# EAGLE design uBike (EAGLE 9.5.1)

## Sheet 1 of 3
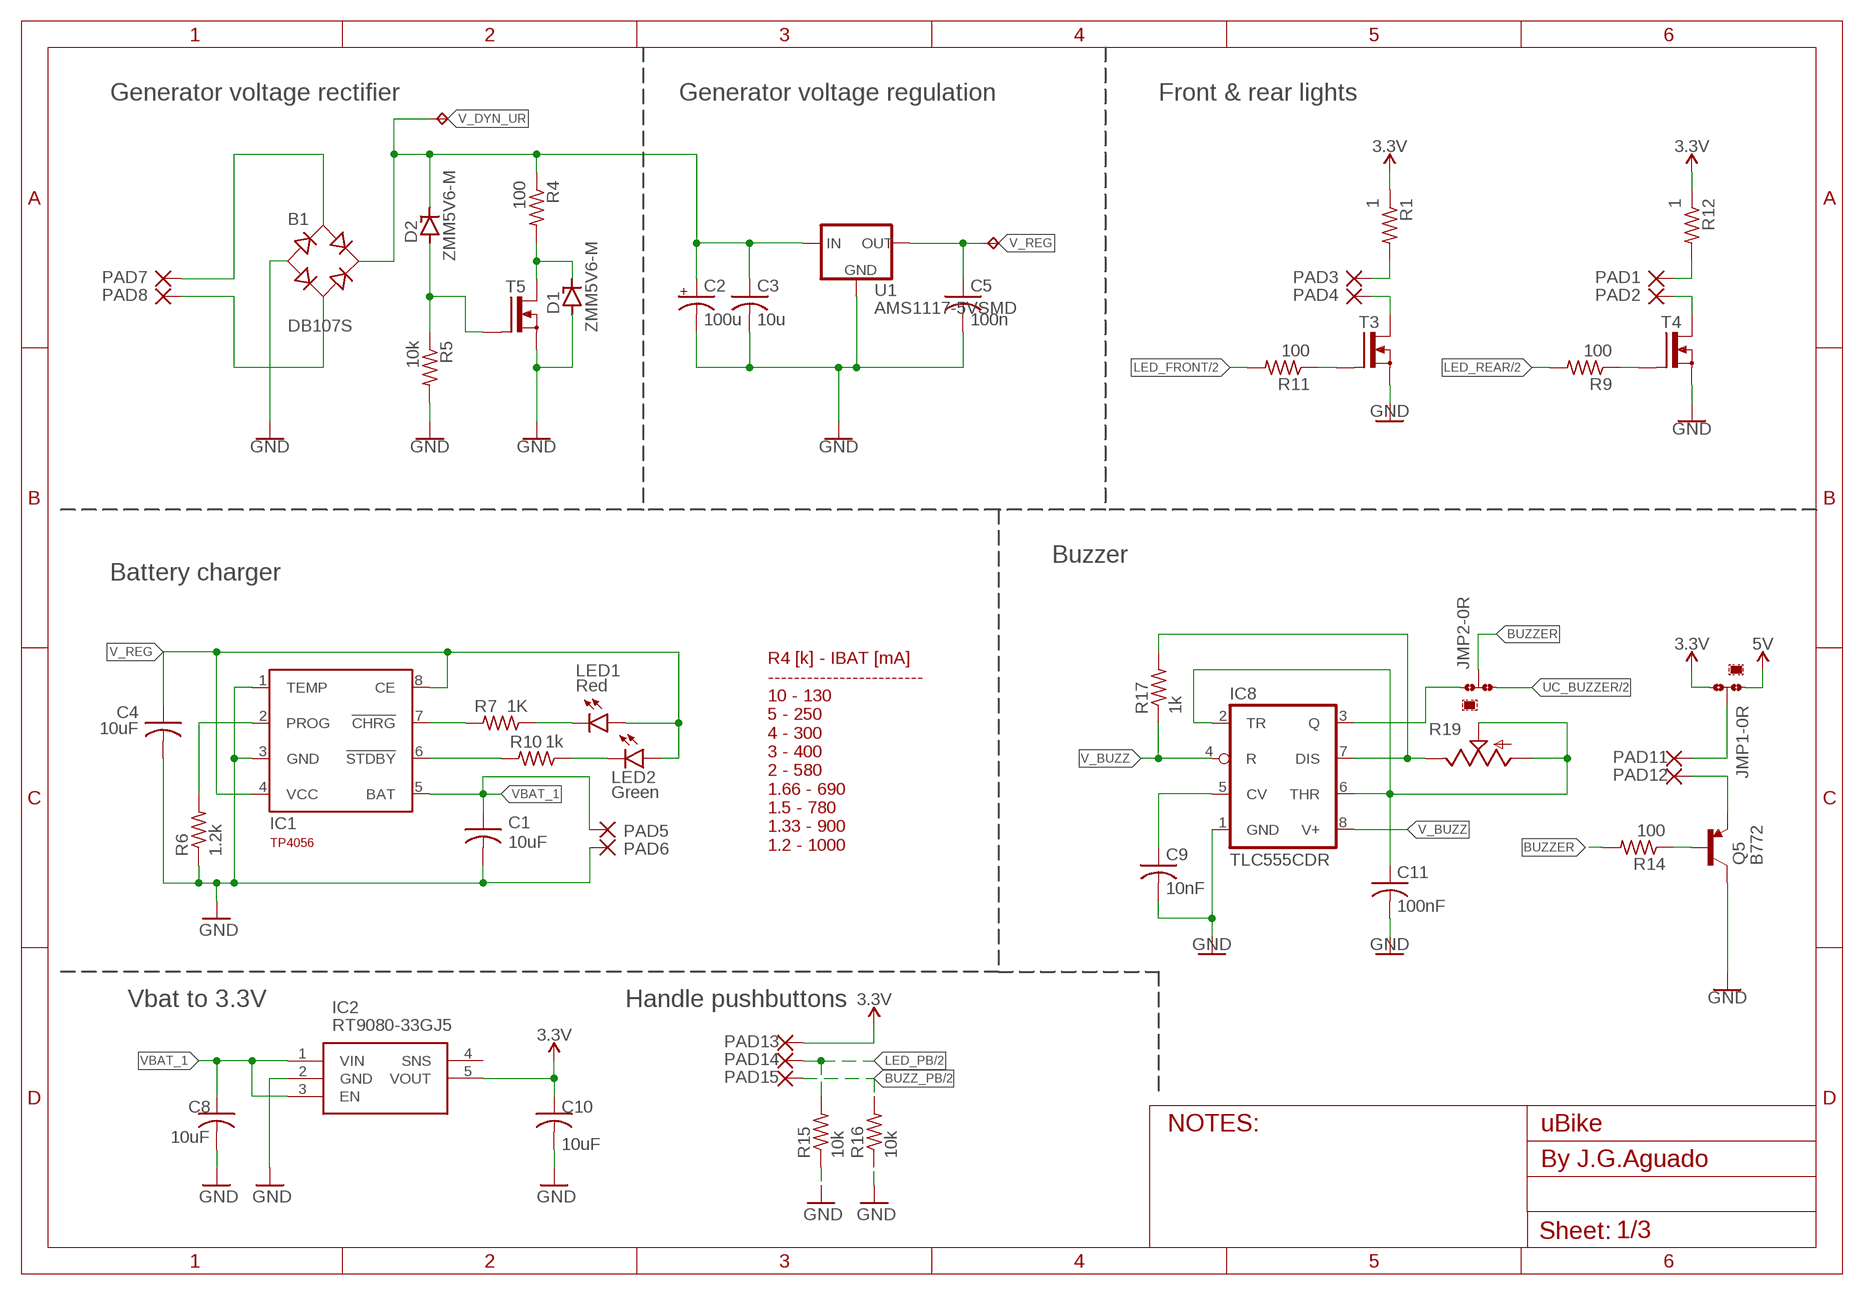
[diagram p0: schematic, sheet 1]

### Parts
B1  DB107S  DBS107G  [DBS]
C1  10uF  C-USC0603  [C0603]
C2  100u  C3528  [B/3528-21R]
C3  10u  C-USC0603  [C0603]
C4  10uF  C-USC0603  [C0603]
C5  100n  C-USC0603  [C0603]
C8  10uF  C-USC0603  [C0603]
C9  10nF  C-USC0603  [C0603]
C10  10uF  C-USC0603  [C0603]
C11  100nF  C-USC0603  [C0603]
D1  ZMM5V6-M  ZD_ZMM5V6_ST_MLL34  [MELF-MLL34]
D2  ZMM5V6-M  ZD_ZMM5V6_ST_MLL34  [MELF-MLL34]
IC1  TP4056  [SOT23-8]
IC2  RT9080-33GJ5  [SOT94P280X100-5N]
IC8  TLC555CDR  NE555D  [SO08]
JMP1  0R-JUMPA  [A0R-JMP]
JMP2  0R-JUMPA  [A0R-JMP]
LED1  Red  LED0603  [LED_0603]
LED2  Green  LED0603  [LED_0603]
PAD1  SMD2  [SMD1,27-2,54]
PAD2  SMD2  [SMD1,27-2,54]
PAD3  SMD2  [SMD1,27-2,54]
PAD4  SMD2  [SMD1,27-2,54]
PAD5  SMD2  [SMD1,27-2,54]
PAD6  SMD2  [SMD1,27-2,54]
PAD7  SMD2  [SMD1,27-2,54]
PAD8  SMD2  [SMD1,27-2,54]
PAD11  SMD2  [SMD1,27-2,54]
PAD12  SMD2  [SMD1,27-2,54]
PAD13  SMD2  [SMD1,27-2,54]
PAD14  SMD2  [SMD1,27-2,54]
PAD15  SMD2  [SMD1,27-2,54]
Q5  B772  TRANSISTOR_PNPSMD-2  [SOT89]
R1  1  R-US_R1206  [R1206]
R4  100  R0402  [0402]
R5  10k  R0402  [0402]
R6  1.2k  R0402  [0402]
R7  1K  R0402  [0402]
R9  100  R0402  [0402]
R10  1k  R0402  [0402]
R11  100  R0402  [0402]
R12  1  R-US_R1206  [R1206]
R14  100  R0402  [0402]
R15  10k  R0402  [0402]
R16  10k  R0402  [0402]
R17  1k  R0402  [0402]
R19  TRIM_US-RJ9W  [RJ9W]
T3  T_N-MOSFET_2N7002_CHANGJ_SOT23-GSD  [SOT23]
T4  T_N-MOSFET_2N7002_CHANGJ_SOT23-GSD  [SOT23]
T5  T_N-MOSFET_2N7002_CHANGJ_SOT23-GSD  [SOT23]
TP1  TPTP15R  [TP15R]
TP3  TPTP15R  [TP15R]
U1  AMS1117-5VSMD  [SOT223]

### Nets
3.3V: C10.1 IC2.5(VOUT) JMP1.3 PAD13.1(P) R1.1 R12.1 ; also sheet 2,3
5V: JMP1.1
BUZZ_PB: PAD15.1(P) R16.2 ; also sheet 2,3
BUZZER: JMP2.2 R14.2
GND: B1.- C1.2 C2.- C3.2 C4.2 C5.2 C8.2 C9.2 C10.2 C11.2 D1.A IC1.1(TEMP) IC1.3(GND) IC2.2(GND) IC8.1(GND) PAD6.1(P) Q5.2(C) R5.2 R6.1 R15.1 R16.1 T3.2(S) T4.2(S) T5.2(S) U1.1(GND) ; also sheet 2,3
LED_FRONT: R11.2 ; also sheet 2,3
LED_PB: PAD14.1(P) R15.2 ; also sheet 2,3
LED_REAR: R9.2 ; also sheet 2,3
N$1: PAD3.1(P) R1.2
N$2: R9.1 T4.1(G)
N$3: IC1.6(!STDBY) R10.2
N$4: PAD4.1(P) T3.3(D)
N$5: R11.1 T3.1(G)
N$6: PAD2.1(P) T4.3(D)
N$7: D2.A R5.1 T5.1(G)
N$8: D1.C R4.2 T5.3(D)
N$10: B1.AC2 PAD8.1(P)
N$11: LED1.C R7.1
N$12: LED2.C R10.1
N$13: IC1.2(PROG) R6.2
N$14: B1.AC1 PAD7.1(P)
N$15: IC1.7(!CHRG) R7.2
N$16: Q5.1(B) R14.1
N$17: PAD12.1(P) Q5.3(E)
N$19: JMP1.2 PAD11.1(P)
N$20: PAD1.1(P) R12.2
N$34: IC8.7(DIS) R17.2 R19.E
N$35: C11.1 IC8.2(TR) IC8.6(THR) R19.A R19.S
N$36: IC8.3(Q) JMP2.1
N$37: C9.1 IC8.5(CV)
UC_BUZZER: JMP2.3 ; also sheet 2,3
V_BUZZ: IC8.4(R) IC8.8(V+) R17.1
V_DYN_UR: B1.+ C2.+ C3.1 D2.C R4.1 TP1.TP U1.3(IN)
V_REG: C4.1 C5.1 IC1.4(VCC) IC1.8(CE) LED1.A LED2.A TP3.TP U1.2(OUT)
VBAT_1: C1.1 C8.1 IC1.5(BAT) IC2.1(VIN) IC2.3(EN) PAD5.1(P)
Unconnected: IC2.4(SNS)

### Notes on the sheet
- Generator voltage rectifier | Generator voltage regulation | Front & rear lights
- Buzzer
- Battery charger
- R4 [k] - IBAT [mA]
  ------------------------
  10 - 130
  5 - 250
  4 - 300
  3 - 400
  2 - 580
  1.66 - 690
  1.5 - 780
  1.33 - 900
  1.2 - 1000
- Vbat to 3.3V | Handle pushbuttons

## Sheet 2 of 3
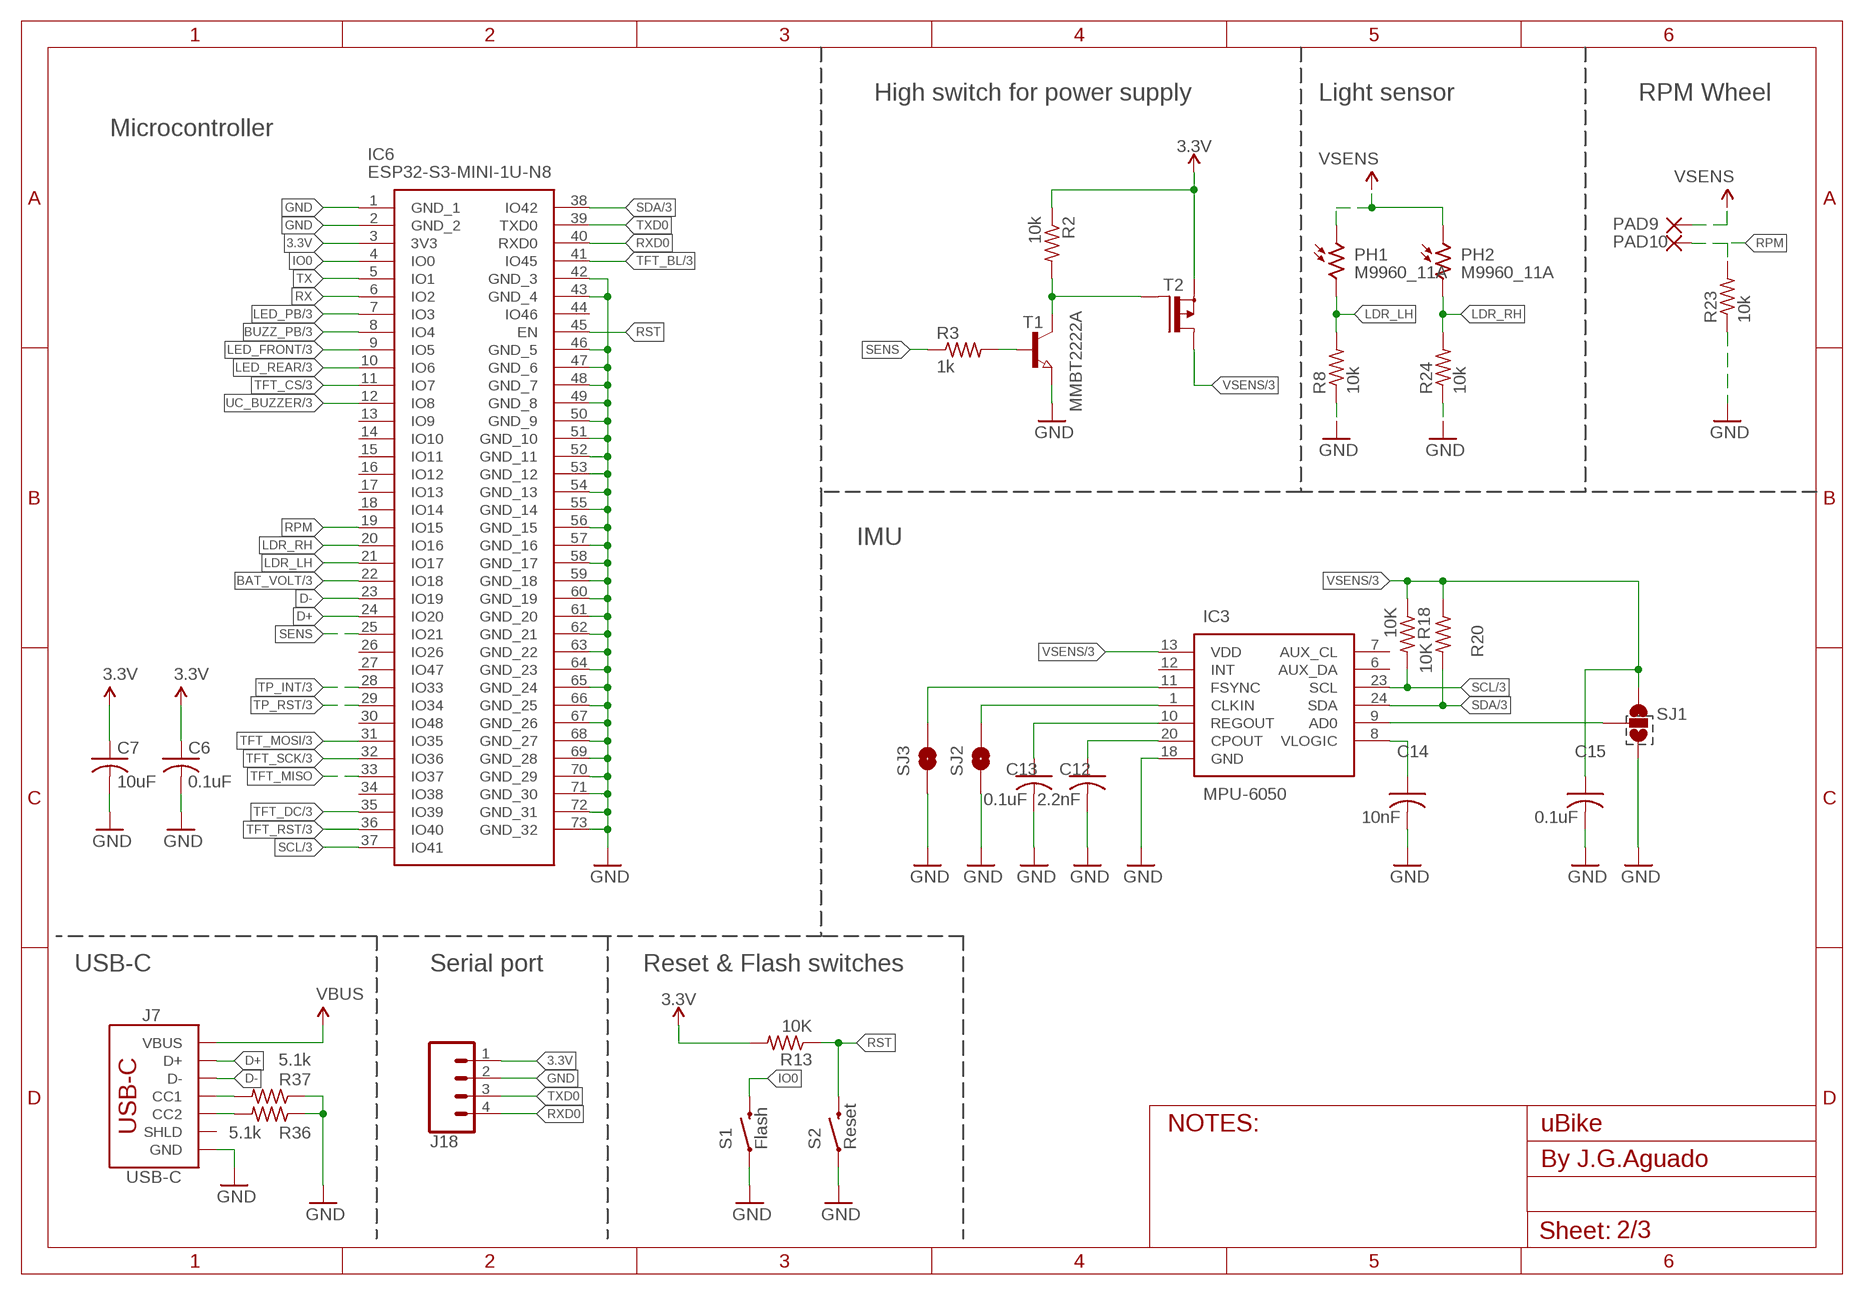
[diagram p1: schematic, sheet 2]

### Parts
C6  0.1uF  C-USC0603  [C0603]
C7  10uF  C-USC0603  [C0603]
C12  2.2nF  C-USC0603  [C0603]
C13  0.1uF  C-USC0603  [C0603]
C14  10nF  C-USC0603  [C0603]
C15  0.1uF  C-USC0603  [C0603]
IC3  MPU-6050  [MPU6050]
IC6  ESP32-S3-MINI-1U-N8  [ESP32S3MINI1UN8]
J7  USB-C  USB_C_4-LAYER-ISOLATED  [USB-C-16P-4LAYER-ISOLATED]
J18  CONN_04PTH  [1X04]
PAD9  SMD2  [SMD1,27-2,54]
PAD10  SMD2  [SMD1,27-2,54]
PH1  M9960_11A  [M9960]
PH2  M9960_11A  [M9960]
R2  10k  R0402  [0402]
R3  1k  R0402  [0402]
R8  10k  R0402  [0402]
R13  10K  R0402  [0402]
R18  10K  R0402  [0402]
R20  10K  R0402  [0402]
R23  10k  R0402  [0402]
R24  10k  R0402  [0402]
R36  5.1k  R-US_R0603  [R0603]
R37  5.1k  R-US_R0603  [R0603]
S1  Flash  MOMENTARY-SWITCH-SPST-SMD-5.2MM-TALL  [TACTILE_SWITCH_SMD_5.2MM]
S2  Reset  MOMENTARY-SWITCH-SPST-SMD-5.2MM-TALL  [TACTILE_SWITCH_SMD_5.2MM]
SJ1  SOLDERJUMPER_2WAYPASTE2&3  [SJ_3_PASTE2&3]
SJ2  SOLDERJUMPERTRACE  [SJ_2S-TRACE]
SJ3  SOLDERJUMPERTRACE  [SJ_2S-TRACE]
T1  MMBT2222A  T_NPN_MMBT2222A-1P_CHANGJ_SOT23-BEC  [SOT23]
T2  T_P-MOSFET_SI2301CDS-T1-GE3_VISHAY_SOT23-GSD  [SOT23]

### Nets
3.3V: C6.1 C7.1 IC6.3(3V3) J18.1 R2.1 R13.2 T2.2(S) ; also sheet 1,3
BAT_VOLT: IC6.22(IO18) ; also sheet 3
BUZZ_PB: IC6.8(IO4) ; also sheet 1,3
CC3: J7.B5(CC2) R36.2
CC4: J7.A5(CC1) R37.2
D+: IC6.24(IO20) J7.A6(D+) J7.B6(D+)
D-: IC6.23(IO19) J7.A7(D-) J7.B7(D-)
GND: C6.2 C7.2 C12.2 C13.2 C14.2 C15.2 IC3.18(GND) IC6.1(GND_1) IC6.2(GND_2) IC6.42(GND_3) IC6.43(GND_4) IC6.46(GND_5) IC6.47(GND_6) IC6.48(GND_7) IC6.49(GND_8) IC6.50(GND_9) IC6.51(GND_10) IC6.52(GND_11) IC6.53(GND_12) IC6.54(GND_13) IC6.55(GND_14) IC6.56(GND_15) IC6.57(GND_16) IC6.58(GND_17) IC6.59(GND_18) IC6.60(GND_19) IC6.61(GND_20) IC6.62(GND_21) IC6.63(GND_22) IC6.64(GND_23) IC6.65(GND_24) IC6.66(GND_25) IC6.67(GND_26) IC6.68(GND_27) IC6.69(GND_28) IC6.70(GND_29) IC6.71(GND_30) IC6.72(GND_31) IC6.73(GND_32) J7.GND J7.GND2(GND) J18.2 R8.1 R23.1 R24.1 R36.1 R37.1 S1.1 S2.1 SJ1.3 SJ2.1 SJ3.1 T1.2(E) ; also sheet 1,3
IO0: IC6.4(IO0) S1.3
LDR_LH: IC6.21(IO17) PH1.2 R8.2
LDR_RH: IC6.20(IO16) PH2.2 R24.2
LED_FRONT: IC6.9(IO5) ; also sheet 1,3
LED_PB: IC6.7(IO3) ; also sheet 1,3
LED_REAR: IC6.10(IO6) ; also sheet 1,3
N$9: R2.2 T1.3(C) T2.1(G)
N$18: R3.2 T1.1(B)
N$38: IC3.11(FSYNC) SJ3.2
N$39: IC3.1(CLKIN) SJ2.2
N$40: C13.1 IC3.10(REGOUT)
N$41: C12.1 IC3.20(CPOUT)
N$43: C14.1 IC3.8(VLOGIC)
N$44: IC3.9(AD0) SJ1.2
RPM: IC6.19(IO15) PAD10.1(P) R23.2
RST: IC6.45(EN) R13.1 S2.3
RX: IC6.6(IO2)
RXD0: IC6.40(RXD0) J18.4
SCL: IC3.23(SCL) IC6.37(IO41) R18.2 ; also sheet 3
SDA: IC3.24(SDA) IC6.38(IO42) R20.2 ; also sheet 3
SENS: IC6.25(IO21) R3.1
TFT_BL: IC6.41(IO45) ; also sheet 3
TFT_CS: IC6.11(IO7) ; also sheet 3
TFT_DC: IC6.35(IO39) ; also sheet 3
TFT_MISO: IC6.33(IO37)
TFT_MOSI: IC6.31(IO35) ; also sheet 3
TFT_RST: IC6.36(IO40) ; also sheet 3
TFT_SCK: IC6.32(IO36) ; also sheet 3
TP_INT: IC6.28(IO33) ; also sheet 3
TP_RST: IC6.29(IO34) ; also sheet 3
TX: IC6.5(IO1)
TXD0: IC6.39(TXD0) J18.3
UC_BUZZER: IC6.12(IO8) ; also sheet 1,3
VBUS: J7.VBUS1(VBUS) J7.VBUS2(VBUS) ; also sheet 3
VSENS: C15.1 IC3.13(VDD) PAD9.1(P) PH1.1 PH2.1 R18.1 R20.1 SJ1.1 T2.3(D) ; also sheet 3
Unconnected: IC3.6(AUX_DA) IC3.7(AUX_CL) IC3.12(INT) IC6.13(IO9) IC6.14(IO10) IC6.15(IO11) IC6.16(IO12) IC6.17(IO13) IC6.18(IO14) IC6.26(IO26) IC6.27(IO47) IC6.30(IO48) IC6.34(IO38) IC6.44(IO46) J7.SHLD1(SHLD) J7.SHLD2(SHLD) J7.SHLD3(SHLD) J7.SHLD4(SHLD) J7.SHLD5(SHLD) J7.SHLD6(SHLD) J7.SHLD7(SHLD) J7.SHLD8(SHLD)

### Notes on the sheet
- High switch for power supply | Light sensor | RPM Wheel
- Microcontroller
- IMU
- USB-C | Serial port | Reset & Flash switches

## Sheet 3 of 3
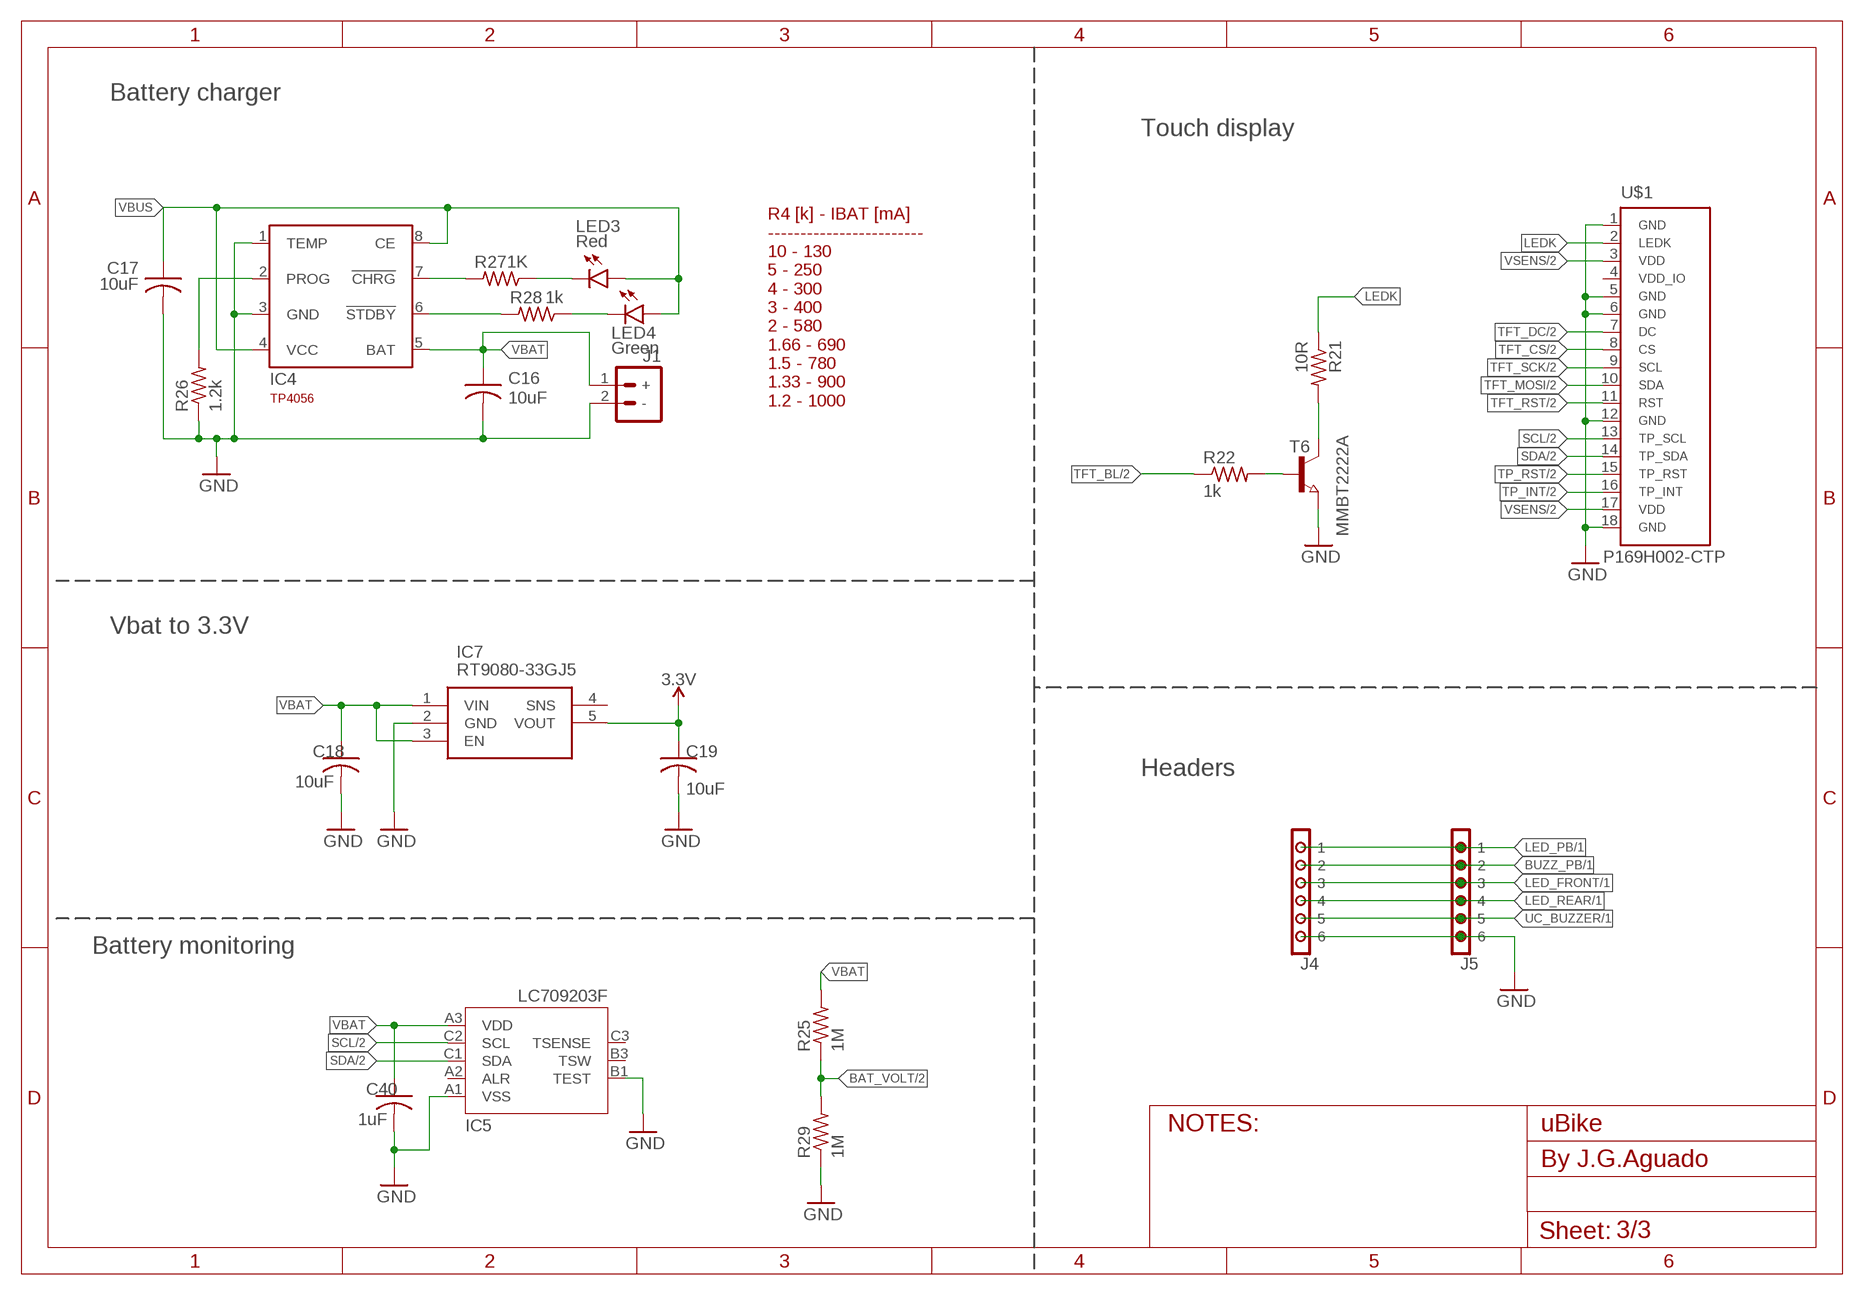
[diagram p2: schematic, sheet 3]

### Parts
C16  10uF  C-USC0603  [C0603]
C17  10uF  C-USC0603  [C0603]
C18  10uF  C-USC0603  [C0603]
C19  10uF  C-USC0603  [C0603]
C40  1uF  C-USC0603  [C0603]
IC4  TP4056  [SOT23-8]
IC5  LC709203F/MH  [WLCSP9]
IC7  RT9080-33GJ5  [SOT94P280X100-5N]
J1  BAT_CONN-JST-2MM-SMT  [JST-2-SMD]
J4  CONN_06  [1X06]
J5  CONN_06  [1X06]
LED3  Red  LED0603  [LED_0603]
LED4  Green  LED0603  [LED_0603]
R21  10R  R0402  [0402]
R22  1k  R0402  [0402]
R25  1M  R0402  [0402]
R26  1.2k  R0402  [0402]
R27  1K  R0402  [0402]
R28  1k  R0402  [0402]
R29  1M  R0402  [0402]
T6  MMBT2222A  T_NPN_MMBT2222A-1P_CHANGJ_SOT23-BEC  [SOT23]
U$1  P169H002-CTP  TOUCH-DISPLAY-FPCBOTTOM  [FPC_18_0.5MM_BOTTOM]

### Nets
3.3V: C19.1 IC7.5(VOUT) ; also sheet 1,2
BAT_VOLT: R25.1 R29.2 ; also sheet 2
BUZZ_PB: J4.2 J5.2 ; also sheet 1,2
GND: C16.2 C17.2 C18.2 C19.2 C40.2 IC4.1(TEMP) IC4.3(GND) IC5.A1(VSS) IC5.B1(TEST) IC7.2(GND) J1.2(-) J4.6 J5.6 R26.1 R29.1 T6.2(E) U$1.1 U$1.5 U$1.6 U$1.12 U$1.18 ; also sheet 1,2
LED_FRONT: J4.3 J5.3 ; also sheet 1,2
LED_PB: J4.1 J5.1 ; also sheet 1,2
LED_REAR: J4.4 J5.4 ; also sheet 1,2
LEDK: R21.1 U$1.2
N$33: R21.2 T6.3(C)
N$46: R22.2 T6.1(B)
N$47: IC4.6(!STDBY) R28.2
N$48: LED3.C R27.1
N$49: LED4.C R28.1
N$50: IC4.2(PROG) R26.2
N$51: IC4.7(!CHRG) R27.2
SCL: IC5.C2(SCL) U$1.13 ; also sheet 2
SDA: IC5.C1(SDA) U$1.14 ; also sheet 2
TFT_BL: R22.1 ; also sheet 2
TFT_CS: U$1.8 ; also sheet 2
TFT_DC: U$1.7 ; also sheet 2
TFT_MOSI: U$1.10 ; also sheet 2
TFT_RST: U$1.11 ; also sheet 2
TFT_SCK: U$1.9 ; also sheet 2
TP_INT: U$1.16 ; also sheet 2
TP_RST: U$1.15 ; also sheet 2
UC_BUZZER: J4.5 J5.5 ; also sheet 1,2
VBAT: C16.1 C18.1 C40.1 IC4.5(BAT) IC5.A3(VDD) IC7.1(VIN) IC7.3(EN) J1.1(+) R25.2
VBUS: C17.1 IC4.4(VCC) IC4.8(CE) LED3.A LED4.A ; also sheet 2
VSENS: U$1.3 U$1.17 ; also sheet 2
Unconnected: IC5.A2(ALR) IC5.B3(TSW) IC5.C3(TSENSE) IC7.4(SNS) U$1.4

### Notes on the sheet
- Battery charger
- Touch display
- R4 [k] - IBAT [mA]
  ------------------------
  10 - 130
  5 - 250
  4 - 300
  3 - 400
  2 - 580
  1.66 - 690
  1.5 - 780
  1.33 - 900
  1.2 - 1000
- Vbat to 3.3V
- Headers
- Battery monitoring

## Library data of the parts
B1 = rectifier:DB?*G: Single Phase 1.0 AMP Glass Passivated Bridge Rectifier Taiwan Semiconductor Co.,Ltd. - TSC Source: http://www.taiwansemi.com/TSCbig5/ezcatfiles/cust/img/img/db101g.pdf http://www.ts.com.tw/db/pictures/modules/PDT/PDT060207001/DBLS201G.pdf; LCSC: C5377
C1 C3-C19 C40 = rcl:C-US: CAPACITOR, American symbol; SPICEPREFIX: C
C2 = SpaceDIY_passive_components:C3528; LCSC: C16133
D1 D2 = JLC PCB Basic Parts_loc:ZD_: Zener Diode; LCSC_DATASHEET: https://datasheet.lcsc.com/lcsc/1809301122_ST-Semtech-ZMM5V6_C8062.pdf; LCSC_PART: C8062; LCSC_PRICE1_EUR: 0.021574803; LCSC_ROTATION_CCW: 180; PROPERTIES: 5.6V <100nA @ 1V 500mW LL-34 Zener Diodes ROHS
IC1 = TP4056:TP4056: TP4056 Data sheet <http://goo.gl/J7k8TF> Dave.Calaway Eagle Library <https://goo.gl/Muy1Tr>; LCSC: C16581
IC2 IC7 = SamacSys_Parts:RT9080-33GJ5: IC REG LIN 3.3V 600MA TSOT23-5 Source: Datasheet <https://www.richtek.com/assets/product_file/RT9080/DS9080-05.pdf>; DESCRIPTION: IC REG LIN 3.3V 600MA TSOT23-5; HEIGHT: 1mm; LCSC: C841192; MANUFACTURER_NAME: RICHTEK; MANUFACTURER_PART_NUMBER: RT9080-33GJ5
IC3 = SpaceDIY_IC:MPU-6050: IMUs - Inertial Measurement Units 6-Axis MEMS MotionTracking Device with DMP Source: Datasheet <https://product.tdk.com/system/files/dam/doc/product/sensor/mortion-inertial/imu/data_sheet/mpu-6000-datasheet1.pdf>; LCSC: C24112
IC4 = TP4056:TP4056: TP4056 Data sheet <http://goo.gl/J7k8TF> Dave.Calaway Eagle Library <https://goo.gl/Muy1Tr>
IC5 = adafruit_sensor:LC709203F; LCSC: C184366
IC6 = SpaceDIY_modules:ESP32-S3-MINI-1U-N8: Espressif Systems SMD module, ESP32-S3, 8 MB SPI flash, IPEX antenna connector Source: Datasheet <https://www.espressif.com/sites/default/files/documentation/esp32-s3-mini-1_mini-1u_datasheet_en.pdf>; DESCRIPTION: Espressif Systems SMD module, ESP32-S3, 8 MB SPI flash, IPEX antenna connector; HEIGHT: 2.55mm; MANUFACTURER_NAME: Espressif Systems; MANUFACTURER_PART_NUMBER: ESP32-S3-MINI-1U-N8; MOUSER_PART_NUMBER: 356-ESP32S3MINI1UN8; MOUSER_PRICE-STOCK: https://www.mouser.co.uk/ProductDetail/Espressif-Systems/ESP32-S3-MINI-1U-N8?qs=IPgv5n7u5QZ2yjt9dMz22g%3D%3D
IC8 = adafruit:*555: TIMER Changed DIP package to have round (not oval) pin pads http://www.ladyada.net/library/pcb/eaglelibrary.html; LCSC: C6986
J1 = SpaceDIY_connectors:BAT_CONN: Multi connection point. Often used as Generic Header-pin footprint for 0.1 inch spaced/style header connections On any of the 0.1 inch spaced packages, you can populate with these: Break Away Headers - Straight <https://www.sparkfun.com/products/116> (PRT-00116) Break Away Male Headers - Right Angle <https://www.sparkfun.com/products/553> (PRT-00553) Female Headers <https://www.sparkfun.com/products/115> (PRT-00115) Break Away Headers - Machine Pin <https://www.sparkfun.com/products/117> (PRT-00117) Break Away Female Headers - Swiss Machine Pin <https://www.sparkfun.com/products/743> (PRT-00743) For SCREWTERMINALS and SPRING TERMINALS visit here: Screw Terimnals on SparkFun.com <https://www.sparkfun.com/search/results?term=Screw+Terminals> (5mm/3.5mm/2.54mm spacing) This device is also useful as a general connection point to wire up your design to another part of your project. Our various solder wires solder well into these plated through hole pads. Hook-Up Wire - Assortment (Stranded, 22 AWG) <https://www.sparkfun.com/products/11375> (PRT-11375) Hook-Up Wire - Assortment (Solid Core, 22 AWG) <https://www.sparkfun.com/products/11367> (PRT-11367) View the entire wire category on our website here <https://www.sparkfun.com/categories/141> Special notes: Molex polarized connector foot print use with: PRT-08233 with associated crimp pins and housings. 2.54_SCREWTERM for use with PRT-10571. 3.5mm Screw Terminal footprints for PRT-08084 5mm Screw Terminal footprints for use with PRT-08432; LCSC: C3029440; PROD_ID: CONN-11443
J4 J5 = SpaceDIY_connectors:CONN_06: Multi connection point. Often used as Generic Header-pin footprint for 0.1 inch spaced/style header connections On any of the 0.1 inch spaced packages, you can populate with these: Break Away Headers - Straight <https://www.sparkfun.com/products/116> (PRT-00116) Break Away Male Headers - Right Angle <https://www.sparkfun.com/products/553> (PRT-00553) Female Headers <https://www.sparkfun.com/products/115> (PRT-00115) Break Away Headers - Machine Pin <https://www.sparkfun.com/products/117> (PRT-00117) Break Away Female Headers - Swiss Machine Pin <https://www.sparkfun.com/products/743> (PRT-00743) Arduino Stackable Header - 10 Pin <https://www.sparkfun.com/products/11376> (PRT-11376) For SCREWTERMINALS and SPRING TERMINALS visit here: Screw Terimnals on SparkFun.com <https://www.sparkfun.com/search/results?term=Screw+Terminals> (5mm/3.5mm/2.54mm spacing) This device is also useful as a general connection point to wire up your design to another part of your project. Our various solder wires solder well into these plated through hole pads. Hook-Up Wire - Assortment (Stranded, 22 AWG) <https://www.sparkfun.com/products/11375> (PRT-11375) Hook-Up Wire - Assortment (Solid Core, 22 AWG) <https://www.sparkfun.com/products/11367> (PRT-11367) View the entire wire category on our website here <https://www.sparkfun.com/categories/141> Special notes: Molex polarized connector foot print use with SKU : PRT-08231 with associated crimp pins and housings. 1MM SMD Version SKU: PRT-10208 NOTES ON THE VARIANTS LOCK and LOCK_LONGPADS... This footprint was designed to help hold the alignment of a through-hole component (i.e. 6-pin header) while soldering it into place. You may notice that each hole has been shifted either up or down by 0.005 of an inch from it's more standard position (which is a perfectly straight line). This slight alteration caused the pins (the squares in the middle) to touch the edges of the holes. Because they are alternating, it causes a "brace" to hold the component in place. 0.005 has proven to be the perfect amount of "off-center" position when using our standard breakaway headers. Although looks a little odd when you look at the bare footprint, once you have a header in there, the alteration is very hard to notice. Also,if you push a header all the way into place, it is covered up entirely on the bottom side.
J7 = SparkFun-Connectors:USB_C: USB Type C 16Pin Connector Super Speed pins not available on the 16-pin purely SMD connector so this part is best for USB 2.0 implementations. D1 and D2 are tied together enabling D+/- no matter which way the cable is plugged into the connector. The two channel configuration pins (CC1/2) are exposed. These are normally connected to ground via 5.1k resistors but can be reconfigured for high current/high power applications. **4-LAYER BOARD WARNING!!** If designing 4-layer board, make sure to select the variant _4-LAYER-ISOLATED. The linked footprint (USB-C-16-4LAYER-ISOLATED) includes some very necessary cutout polygons in the inner layers (2 and 15). This prevents the PTH mounting shield legs on the USB connector from electrically connecting any other polygons on the inner layers (usually VCC and GND).; LCSC: C2765186; PROD_ID: CONN-14122; VALUE: USB Female Type C Connector
J18 = SparkFun-Connectors:CONN_04: Multi connection point. Often used as Generic Header-pin footprint for 0.1 inch spaced/style header connections On any of the 0.1 inch spaced packages, you can populate with these: Break Away Headers - Straight <https://www.sparkfun.com/products/116> (PRT-00116) Break Away Male Headers - Right Angle <https://www.sparkfun.com/products/553> (PRT-00553) Female Headers <https://www.sparkfun.com/products/115> (PRT-00115) Break Away Headers - Machine Pin <https://www.sparkfun.com/products/117> (PRT-00117) Break Away Female Headers - Swiss Machine Pin <https://www.sparkfun.com/products/743> (PRT-00743) For SCREWTERMINALS and SPRING TERMINALS visit here: Screw Terimnals on SparkFun.com <https://www.sparkfun.com/search/results?term=Screw+Terminals> (5mm/3.5mm/2.54mm spacing) This device is also useful as a general connection point to wire up your design to another part of your project. Our various solder wires solder well into these plated through hole pads. Hook-Up Wire - Assortment (Stranded, 22 AWG) <https://www.sparkfun.com/products/11375> (PRT-11375) Hook-Up Wire - Assortment (Solid Core, 22 AWG) <https://www.sparkfun.com/products/11367> (PRT-11367) View the entire wire category on our website here <https://www.sparkfun.com/categories/141> Special notes: Molex polarized connector foot print use with SKU : PRT-08231 with associated crimp pins and housings. 1MM SMD Version SKU: PRT-10208; PROD_ID: CONN-09696
JMP1 JMP2 = jump-0r-smd:0R-JUMP: SMD 0R 0805 Jumper
LED1-LED4 = SpaceDIY_semiconductors:LED: LED (Generic) Standard schematic elements and footprints for 5mm, 3mm, 0402, 0603 , 0805 and 1206 sized LEDs. Generic LEDs with no color specified.
PAD1-PAD15 = wirepad:SMD2: SMD PAD
PH1 PH2 = photo-elements:M9960_11: Photo Sensor Beacon Light, Photometer Applications Source: http://optoelectronics.perkinelmer.com/content/Datasheets/DTS_M9960.pdf
Q5 = User-Submitted:TRANSISTOR_PNP: Generic PNP BJT Double check pinouts against datasheets- not all devices are the same! MMBT3906 - 40V 200mA SOT-23 (TRANS-08052) MMBT4403 - 40V 600mA SOT-23 (TRANS-09245); LCSC: C24278
R1 R12 = rcl:R-US_: RESISTOR, American symbol; LCSC: C17928; SPICEPREFIX: R
R2 R3 R6-R11 R13-R18 R20-R29 = SpaceDIY_passive_components:R0402
R4 R5 = SpaceDIY_passive_components:R0402; LCSC: C17928
R19 = pot:TRIM_US-: POTENTIOMETER
R36 R37 = rcl:R-US_: RESISTOR, American symbol; SPICEPREFIX: R
S1 S2 = SpaceDIY_electromechanical:MOMENTARY-SWITCH-SPST: Momentary Switch (Pushbutton) - SPST Normally-open (NO) SPST momentary switches (buttons, pushbuttons). Variants PTH-12MM - 12mm square, through-hole Momentary Pushbutton Switch - 12mm Square <https://www.sparkfun.com/products/9190> (COM-09190) PTH-6.0MM, PTH-6.0MM-KIT - 6.0mm square, through-hole Mini Pushbutton Switch <https://www.sparkfun.com/products/97> (COM-00097) KIT package intended for soldering kit's - only one side of pads' copper is exposed. PTH-RIGHT-ANGLE-KIT - Right-angle, through-hole Right Angle Tactile Button <https://www.sparkfun.com/products/10791> - Used on SparkFun BigTime Watch Kit <https://www.sparkfun.com/products/11734> SMD-12MM - 12mm square, surface-mount Tactile Button - SMD (12mm) <https://www.sparkfun.com/products/12993> (COM-12993) Used on SparkFun PicoBoard <https://www.sparkfun.com/products/11888> SMD-4.5MM - 4.5mm Square Trackball Switch Used on SparkFun Blackberry Trackballer Breakout <https://www.sparkfun.com/products/13169> SMD-4.6MMX2.8MM - 4.60mm x 2.80mm, surface mount Used on SparkFun Pro Micro - RP2040 <https://www.sparkfun.com/products/17717> SMD-5.2MM, SMD-5.2-REDUNDANT - 5.2mm square, surface-mount Mini Pushbutton Switch - SMD <https://www.sparkfun.com/products/8720> (COM-08720) Used on Arduino Pro Mini <https://www.sparkfun.com/products/11114> REDUNDANT package connects both switch circuits together SMD-6.0X3.5MM - 6.0 x 3.5mm, surface mount Momentary Reset Switch SMD <https://www.sparkfun.com/products/8229> (COM-08229) SMD-6.2MM-TALL - 6.2mm square, surface mount Tactile Button - SMD (6mm) <https://www.sparkfun.com/products/12992> Used on SparkFun Digital Sandbox <https://www.sparkfun.com/products/12651> SMD-RIGHT-ANGLE - Right-angle, surface mount Used on SparkFun Block for Intel® Edison - Arduino <https://www.sparkfun.com/products/13036>; LCSC: C318884; PROD_ID: SWCH-14139
SJ1 = SparkFun:SOLDERJUMPER_2WAY: Solder Jumper 2 way solder jumper
SJ2 SJ3 = SparkFun:SOLDERJUMPER: Solder Jumper Standard SMD solder jumper. Used to automate production. Two varients : Normally Open and Normally Closed are the same, but have different paste layers. NC will have a large amount of paste and should jumper during reflow.
T1 T6 = JLC PCB Basic Parts_loc:T_NPN_: Transistor NPN; LCSC_DATASHEET: https://datasheet.lcsc.com/lcsc/1811081957_Changjiang-Electronics-Tech--CJ-MMBT2222A-1P_C8512.pdf; LCSC_PART: C8512; LCSC_PRICE1_EUR: 0.023149606; LCSC_ROTATION_CCW: 180; PROPERTIES: 0.3W NPN 0.6A 40V SOT-23(SOT-23-3) Bipolar Transistors - BJT ROHS
T2 = JLC PCB Basic Parts_loc:T_P-MOSFET_: Transistor P-MOSFET; LCSC_DATASHEET: https://datasheet.lcsc.com/lcsc/1808272021_Vishay-Intertech-SI2301CDS-T1-GE3_C10487.pdf; LCSC_PART: C10487; LCSC_PRICE1_EUR: 0.091023622; LCSC_ROTATION_CCW: 180; PROPERTIES: 0.112Ohm 2.8A,4.5V 1V 250uA 3.1A 0.86W 20V P Channel SOT-23(SOT-23-3) MOSFETs ROHS
T3-T5 = JLC PCB Basic Parts_loc:T_N-MOSFET_: Transistor N-MOSFET; LCSC_DATASHEET: https://datasheet.lcsc.com/lcsc/1810151612_Changjiang-Electronics-Tech--CJ-2N7002_C8545.pdf; LCSC_PART: C8545; LCSC_PRICE1_EUR: 0.026614173; LCSC_ROTATION_CCW: 180; PROPERTIES: 2.5V 250uA 0.115A 60V N Channel 7.5Ohm 500mA,10V 0.2W SOT-23(SOT-23-3) MOSFETs ROHS
TP1 TP3 = testpad:TP: Test pad
U1 = SpaceDIY_IC:AMS1117-: Voltage Regulator Standard LM317 adjustable voltage regulator. AOI (Adjust Output Input). Google 'LM317 Calculator' for easy to use app to get the two resistor values needed. 240/720 for 5V output. 240/390 for 3.3V output. Spark Fun Electronics SKU : COM-00527; LCSC: C6187
U$1 = SpaceDIY_connectors:TOUCH-DISPLAY-FPC; LCSC: C262326

## Net classes
2 Clock: width 0.089 mm, clearance 0.178 mm

## Board
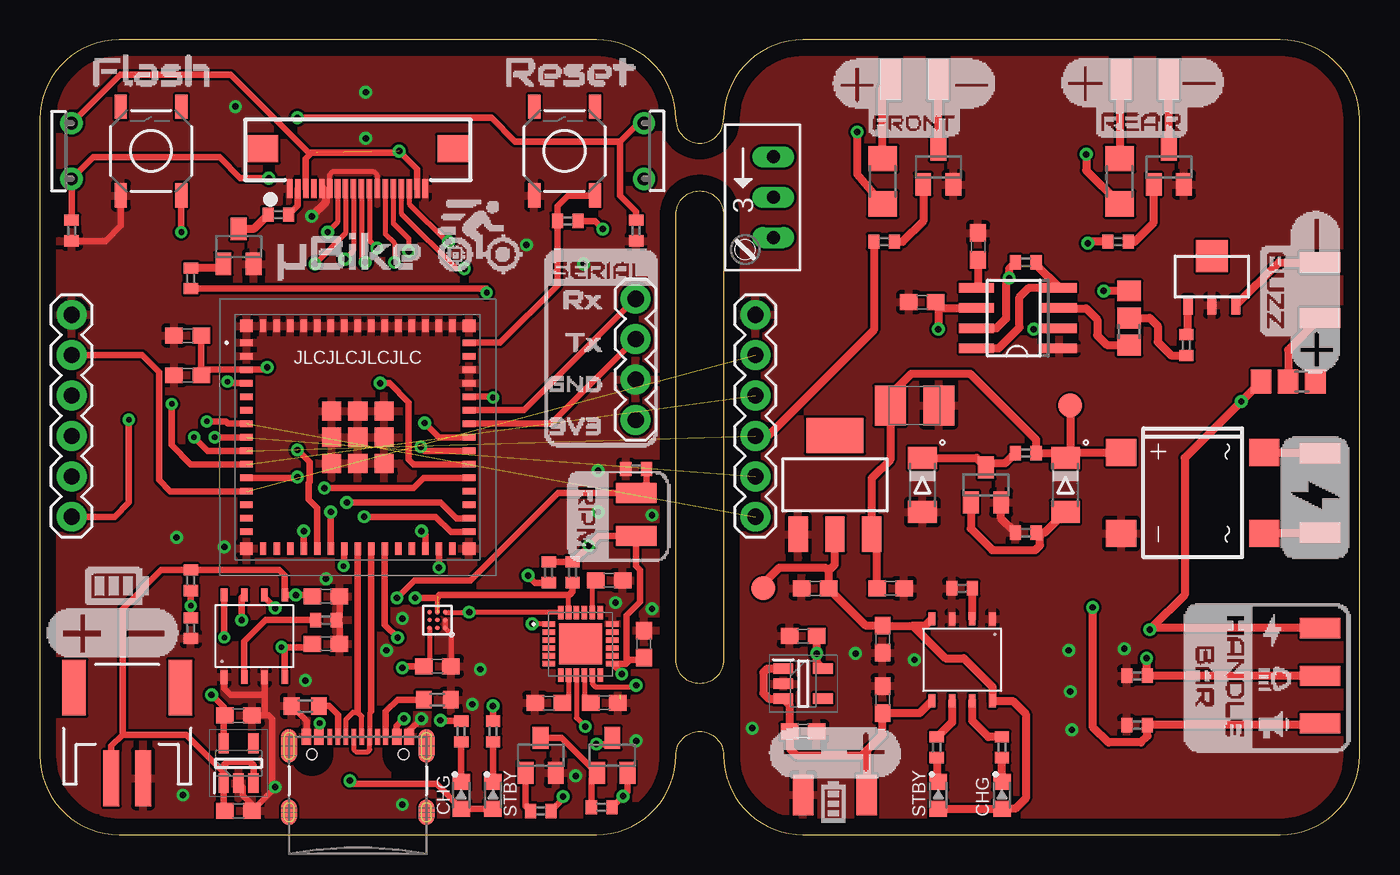
[diagram p3: board, top side]
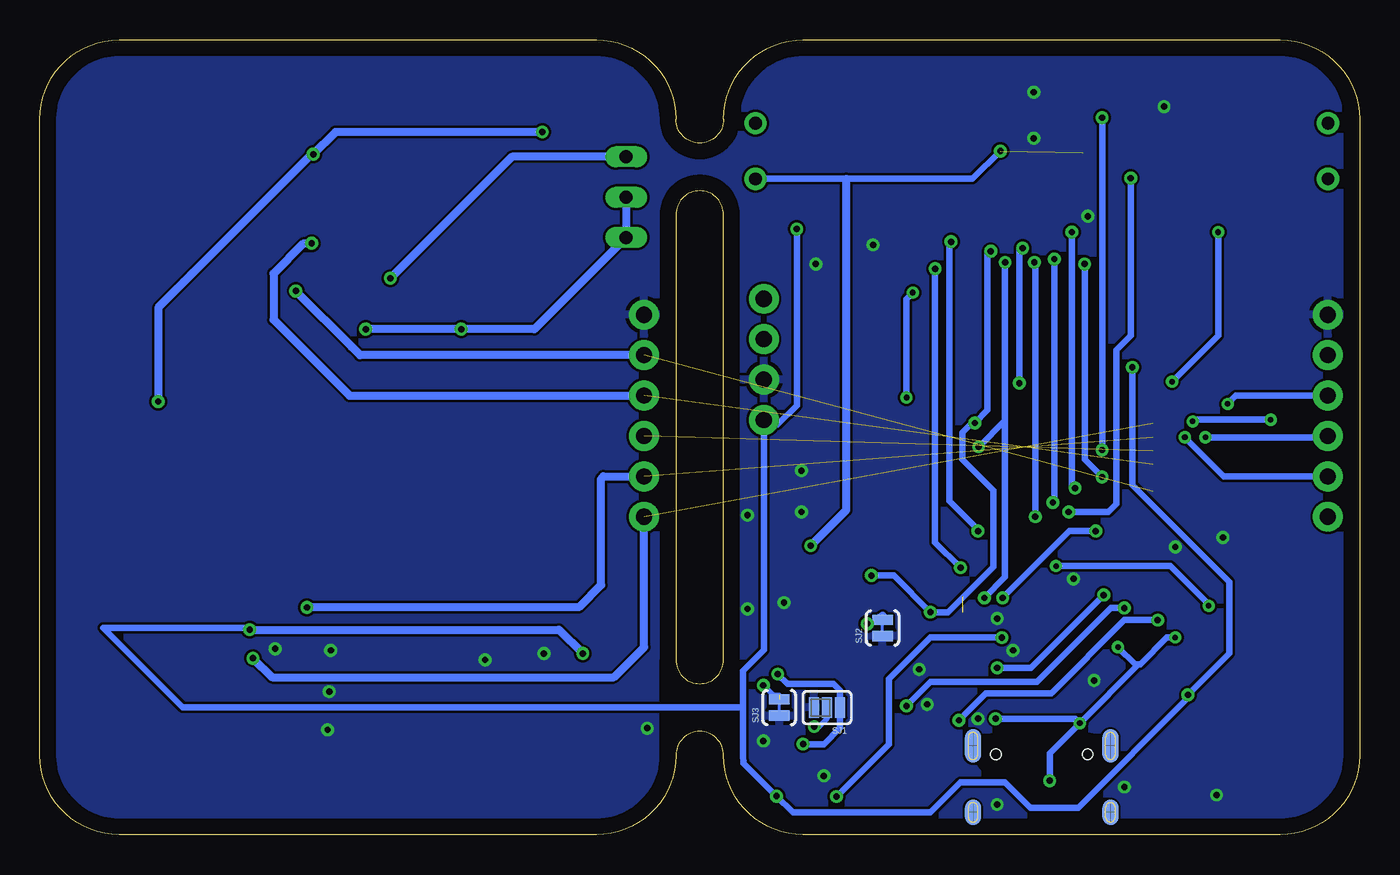
[diagram p4: board, bottom side, seen from below]

Size 83 x 50 mm. Coordinates in mm from the lower left corner, seen from the top.
Outline: 0,5 arc90 5,0 35,0 arc90 40,5 arc-180 43,5 arc90 48,0 78,0 arc90 83,5 83,45 arc90 78,50 48,50 arc90 43,45 arc-180 40,45 arc90 35,50 5,50 arc90 0,45 0,5
Outline: 40,39 arc-90 41.5,40.5 arc-90 43,39 43,11 arc-90 41.5,9.5 arc-90 40,11 40,39
Copper layers (1*16): Top 0.035mm / dielectric 1.5mm / Bottom 0.035mm
Design rules "default": minimum track width 6mil, minimum drill 0.35mm, track to track 6mil, track to pad 6mil, pad to pad 6mil, via to via 6mil, smd to smd 6mil, copper to edge 40mil, drill to drill 6mil, minimum pad ring 10mil, minimum via ring 8mil, stop-mask expansion 4mil, vias tented up to drill 0mil, thermal gap 10mil
tRestrict: area 39,5 to 44,11
bRestrict: area 40,5 to 44,11

### Footprints (pad centres in the part's own frame; a part is rotated, then mirrored left to right if it is on the bottom)
DBS = smd 1.7 x 1.9: + -2.55,-4.5; - 2.55,-4.5; AC1 -2.55,4.5; AC2 2.55,4.5
C0603 = smd 1.1 x 1: 1 -0.85,0; 2 0.85,0
B/3528-21R = smd 1.95 x 2.5: + 1.525,0; - -1.525,0
MELF-MLL34 = smd 1.4 x 1.8: A 1.7,0; C -1.7,0
SOT23-8 = smd 0.42 x 0.835: 1 -1.905,-2.58; 2 -0.635,-2.58; 3 0.635,-2.58; 4 1.905,-2.58; 5 1.905,2.58; 6 0.635,2.58; 7 -0.635,2.58; 8 -1.905,2.58
SOT94P280X100-5N = smd 1.25 x 0.65: 1 -1.25,0.94; 2 -1.25,0; 3 -1.25,-0.94; 4 1.25,-0.94; 5 1.25,0.94
MPU6050 = smd 0.8 x 0.35: 1 -2,1.25; 2 -2,0.75; 3 -2,0.25; 4 -2,-0.25; 5 -2,-0.75; 6 -2,-1.25; 13 2,-1.25; 14 2,-0.75; 15 2,-0.25; 16 2,0.25; 17 2,0.75; 18 2,1.25 | smd 0.35 x 0.85: 7 -1.25,-1.975; 8 -0.75,-1.975; 9 -0.25,-1.975; 10 0.25,-1.975; 11 0.75,-1.975; 12 1.25,-1.975; 19 1.25,1.975; 20 0.75,1.975; 21 0.25,1.975; 22 -0.25,1.975; 23 -0.75,1.975; 24 -1.25,1.975 | smd 2.7 x 2.6: 25 0,0
WLCSP9 = smd 0.275 x 0.275: A1 -0.5,0.5; A2 0,0.5; A3 0.5,0.5; B1 -0.5,0; B2 0,0; B3 0.5,0; C1 -0.5,-0.5; C2 0,-0.5; C3 0.5,-0.5
ESP32S3MINI1UN8 = smd 0.8 x 0.4: 1 -7,5.95; 2 -7,5.1; 3 -7,4.25; 4 -7,3.4; 5 -7,2.55; 6 -7,1.7; 7 -7,0.85; 8 -7,0; 9 -7,-0.85; 10 -7,-1.7; 11 -7,-2.55; 12 -7,-3.4; 13 -7,-4.25; 14 -7,-5.1; 15 -7,-5.95; 31 7,-5.95; 32 7,-5.1; 33 7,-4.25; 34 7,-3.4; 35 7,-2.55; 36 7,-1.7; 37 7,-0.85; 38 7,0; 39 7,0.85; 40 7,1.7; 41 7,2.55; 42 7,3.4; 43 7,4.25; 44 7,5.1; 45 7,5.95 | smd 0.4 x 0.8: 16 -5.95,-7; 17 -5.1,-7; 18 -4.25,-7; 19 -3.4,-7; 20 -2.55,-7; 21 -1.7,-7; 22 -0.85,-7; 23 0,-7; 24 0.85,-7; 25 1.7,-7; 26 2.55,-7; 27 3.4,-7; 28 4.25,-7; 29 5.1,-7; 30 5.95,-7; 46 5.95,7; 47 5.1,7; 48 4.25,7; 49 3.4,7; 50 2.55,7; 51 1.7,7; 52 0.85,7; 53 0,7; 54 -0.85,7; 55 -1.7,7; 56 -2.55,7; 57 -3.4,7; 58 -4.25,7; 59 -5.1,7; 60 -5.95,7 | smd 1.2 x 1.2: 61 0,0; 66 -1.65,1.65; 67 -1.65,0; 68 -1.65,-1.65; 69 0,-1.65; 70 1.65,-1.65; 71 1.65,0; 72 1.65,1.65; 73 0,1.65 | smd 0.8 x 0.8: 62 -7,7; 63 -7,-7; 64 7,-7; 65 7,7
SO08 = smd 0.6 x 2.2: 1 -1.905,-2.6; 2 -0.635,-2.6; 3 0.635,-2.6; 4 1.905,-2.6; 5 1.905,2.6; 6 0.635,2.6; 7 -0.635,2.6; 8 -1.905,2.6
JST-2-SMD = smd 1 x 3.5: 1 1,3.95; 2 -1,3.95 | smd 1.5 x 3.5: NC1 3.35,-1.75; NC2 -3.35,-1.75
1X06 = drill 1.016 pad 1.88: 1 0,0; 2 2.54,0; 3 5.08,0; 4 7.62,0; 5 10.16,0; 6 12.7,0
USB-C-16P-4LAYER-ISOLATED = smd 0.3 x 1: A5 -1.25,-0.34; A6 -0.25,-0.34; A7 0.25,-0.34; A8 1.25,-0.34; B5 1.75,-0.34; B6 0.75,-0.34; B7 -0.75,-0.34; B8 -1.75,-0.34 | smd 0.6 x 1: GND -3.225,-0.34; GND2 3.225,-0.34; VBUS1 -2.45,-0.34; VBUS2 2.45,-0.34 | smd 1 x 2.1: SHLD1 -4.32,-0.915; SHLD2 4.32,-0.915 | smd 1 x 2.1 bottom: SHLD3 -4.32,-0.915; SHLD4 4.32,-0.915 | smd 1 x 1.6: SHLD5 -4.32,-5.095; SHLD8 4.32,-5.095 | smd 1 x 1.6 bottom: SHLD6 -4.32,-5.095; SHLD7 4.32,-5.095 | hole 0.65: -2.89,-1.445; 2.89,-1.445
1X04 = drill 1.016 pad 1.88: 1 0,0; 2 2.54,0; 3 5.08,0; 4 7.62,0
A0R-JMP = smd 1.5 x 1.3: 1 0,1.7; 2 0,0; 3 0,-1.7
LED_0603 = smd 1 x 1.1: A -0.86,0; C 0.84,0
SMD1,27-2,54 = smd 1.27 x 2.54: 1 0,0
M9960 = drill 0.8 pad 1.4: 1 -1.75,0; 2 1.75,0
SOT89 = smd 0.58 x 1.2: 1 -1.5,-1.8; 2 0,-1.8; 3 1.5,-1.8 | smd 2 x 2: 4 0,1.3
R1206 = smd 1.6 x 1.803: 1 -1.422,0; 2 1.422,0
0402 = smd 0.7 x 0.9: 1 -0.65,0; 2 0.65,0
RJ9W = drill 0.813 long: A 2.54,0.635; E -2.54,0.635; S 0,0.635
R0603 = smd 1 x 1.1: 1 -0.85,0; 2 0.85,0
TACTILE_SWITCH_SMD_5.2MM = smd 1.524 x 0.762: 1 -2.794,1.905; 2 2.794,1.905; 3 -2.794,-1.905; 4 2.794,-1.905
SJ_3_PASTE2&3 = smd 0.635 x 1.27: 1 -0.813,0; 2 0,0; 3 0.813,0
SJ_2S-TRACE = smd 0.635 x 1.27: 1 -0.508,0; 2 0.508,0
SOT23 = smd 1.4 x 1: 1 -1.1,0.95; 2 -1.1,-0.95; 3 1.1,0
TP15R = smd 1.5 x 1.5: TP 0,0
SOT223 = smd 1.219 x 2.235: 1 -2.311,-3.099; 2 0,-3.099; 3 2.311,-3.099 | smd 3.6 x 2.2: 4 0,3.099
FPC_18_0.5MM_BOTTOM = smd 0.35 x 1.2: 1 -4.27,-3.354; 2 -3.77,-3.354; 3 -3.27,-3.354; 4 -2.77,-3.354; 5 -2.27,-3.354; 6 -1.77,-3.354; 7 -1.27,-3.354; 8 -0.77,-3.354; 9 -0.27,-3.354; 10 0.23,-3.354; 11 0.73,-3.354; 12 1.23,-3.354; 13 1.73,-3.354; 14 2.23,-3.354; 15 2.73,-3.354; 16 3.23,-3.354; 17 3.73,-3.354; 18 4.23,-3.354 | smd 2 x 1.7: P$25 6,-0.85; P$26 -6,-0.85

### Placement (x,y rotation side)
B1  72.5,21.5 270 top
C1  53,8.5 90 top
C2  55,27 180 top
C3  53.5,15.5 0 top
C4  53,12.3 270 top
C5  48.75,15.5 180 top
C6  9.3,31.4 180 top
C7  9.3,28.9 180 top
C8  48,6.5 0 top
C9  59,37 90 top
C10  48,12.5 180 top
C11  55.5,33.5 180 top
C12  35.8,16 0 top
C13  35.5,8.3 0 top
C14  32,8.3 180 top
C15  38,12 90 top
C16  18,15 0 top
C17  18,12 0 top
C18  12.5,1.5 0 top
C19  12.5,7.5 0 top
C40  25,10.6 0 top
D1  55.5,22 270 top
D2  64.5,22 270 top
IC1  58,11 180 top
IC2  48,9.5 0 top
IC3  34,12 0 top
IC4  13.5,12.5 0 top
IC5  25,13.5 180 top
IC6  20,25 0 top
IC7  12.5,4.5 90 top
IC8  61.5,32.5 90 top
J1  5.5,7.5 180 top
J4  2,20 90 top
J5  45,20 90 top
J7  20,6.5 0 top
J18  37.47,26.09 90 top
JMP1  78.5,28.5 270 top
JMP2  68.5,32.5 180 top
LED1  60.5,2.5 90 top
LED2  56.5,2.5 90 top
LED3  26.5,2.5 90 top
LED4  28.5,2.5 90 top
PAD1  68,47.5 0 top
PAD2  71,47.5 0 top
PAD3  53.5,47.5 180 top
PAD4  56.5,47.5 180 top
PAD5  52,2.5 180 top
PAD6  48,2.5 0 top
PAD7  80.5,24 90 top
PAD8  80.5,19 90 top
PAD9  37.5,18.8 90 top
PAD10  37.5,21.5 90 top
PAD11  80.5,32.5 90 top
PAD12  80.5,36 90 top
PAD13  80.5,13 90 top
PAD14  80.5,10 90 top
PAD15  80.5,7 90 top
PH1  2,43 270 top
PH2  38,43 90 top
Q5  73.7,35.1 0 top
R1  53,41.1 90 top
R2  35.33,1.73 180 top
R3  31.5,1.5 180 top
R4  62,24 180 top
R5  62,19 180 top
R6  58,15.5 0 top
R7  60.5,5.5 90 top
R8  2,38 90 top
R9  67.8,37.3 180 top
R10  56.4,5.5 90 top
R11  53.1,37.3 180 top
R12  67.9,41.1 90 top
R13  33.2,38.6 0 top
R14  72.1,30.8 270 top
R15  69,10 0 top
R16  69,6.9 0 top
R17  62,36 180 top
R18  33.5,16.5 270 top
R19  45.5,40.1 270 top
R20  32,16.5 270 top
R21  15,39 180 top
R22  9.5,35 90 top
R23  37.5,23 0 top
R24  37.5,38 90 top
R25  9.5,16 90 top
R26  18,13.5 180 top
R27  26.5,6.5 90 top
R28  28.5,6.5 90 top
R29  9.5,13 90 top
R36  25,8.5 180 top
R37  16.7,8.1 0 top
S1  7,43 90 top
S2  33,43 90 top
SJ1  33.5,8 180 bottom
SJ2  30,13 90 bottom
SJ3  36.5,8 90 bottom
T1  31.5,5 90 top
T2  36,5 90 top
T3  56.5,42 90 top
T4  71,42 90 top
T5  59.5,22 90 top
T6  12.5,37 90 top
TP1  64.8,27 180 top
TP3  45.5,15.5 180 top
U1  50,22 0 top
U$1  20,44 0 top

### Tracks (layer width: path | path; a pad name or v marks a point on that pad's centre or on a via)
3.3V  (via drill 0.4)
  Top 0.406: C6.1 10.15,29.2 | 10.15,29.2 C7.1 | 10.15,29.2 10.2,29.25 IC6.3 14.15,29.25 v14.3,29.4 | C19.1 11.56,7.41 | 11.56,7.41 IC7.5 | v10.8,8.8 11.56,8.04 11.56,7.41 | R2.1 v36.68,2.42 36.95,2.7 T2.2 | R13.2 34.9,38.6 v35.4,38.1
  Top 0.508: C10.1 v48.85,11.4 48.85,10.84 IC2.5 | PAD13.1 69.9,13 | 69.9,13 v69.8,12.9 | JMP1.3 v75.55,27.25 72,23.7 72,15.1 69.9,13 | v65.8,42.8 65.8,41.78 R12.1 | R1.1 51.4,41.58 v51.4,44.2
  Bottom 0.406: v14.3,29.4 14.3,22 8.2,15.9 8.2,11.4 v10.8,8.8 10.8,8.6 17.7,1.7 20.7,1.7 22.3,3.3 25.1,3.3 27,1.4 35.65,1.4 v36.68,2.42 38.73,4.48 38.78,5 38.78,8 | J18.1 37.47,25.8 | 37.47,25.8 37.47,11.63 38.78,10.32 38.78,8 | v35.4,38.1 35.4,27 36.6,25.8 37.47,25.8 | 38.78,8 74,8 79,13 69.9,13 v69.8,12.9
  Bottom 0.508: v69.8,12.9 50.35,12.9 v48.85,11.4 | v75.55,27.25 75.55,33.15 65.9,42.8 v65.8,42.8 64.4,44.2 v51.4,44.2
BAT_VOLT  (via drill 0.35)
  Top 0.406: R29.2 v9.5,14.4 R25.1 | IC6.22 19.15,16.95 v19.1,16.9
  Bottom 0.406: v19.1,16.9 11.9,16.9 9.5,14.5 v9.5,14.4
BUZZ_PB  (via drill 0.35, 0.4)  (1 unrouted)
  Top 0.406: v11,25 IC6.8
  Top 0.508: PAD15.1 80.4,6.9 R16.2 69.65,6.2 69.25,5.8 67.2,5.8 66.2,6.8 v66.2,14.3
  Bottom 0.406: J4.2 8.54,22.54 v11,25
  Bottom 0.508: v66.2,14.3 49.1,14.3 47.7,15.7 47.7,22.4 47.56,22.54 J5.2
BUZZER
  Top 0.508: JMP2.2 69.8,32.5 70.3,32 70.3,31 71.15,30.15 R14.2
CC3
  Top 0.406: J7.B5 21.75,7.75 22.5,8.5 R36.2
CC4
  Top 0.406: J7.A5 18.75,7.55 18.2,8.1 R37.2
D+
  Top 0.305: 20.85,7.75 20.75,7.65 J7.B6 20.75,5.35 20.6,5.2 19.9,5.2 19.75,5.35 J7.A6
  Top 0.406: IC6.24 20.85,7.75
D-
  Top 0.305: J7.B7 19.25,7.25 19.7,7.7 20,7.7 20.25,7.45 J7.A7
  Top 0.406: 20,7.7 IC6.23
GND  (via drill 0.4)
  Top 0.305: IC5.B1 IC5.A1 25.85,12.65 C40.2 | U$1.12 21.23,41.47 21,41.7 18.4,41.7 18.2,41.5 18.2,40.68 U$1.6
  Top 0.406: R8.1 4.15,37.35 5.09,38.3 S1.1 | J7.GND 16.77,7.17 R37.1 | IC7.2 12.76,2.99 12.76,2.48 13.35,1.89 C18.2 14.6,2.75 14.6,7.3 14.4,7.5 14,7.5 | 14,7.5 C19.2 | IC4.3 14.13,8.8 | 14.13,8.8 14.13,7.63 14,7.5 | IC4.1 11.6,9.21 12,8.8 14.13,8.8 | J7.GND2 23.23,6.53 v24,7.3 | C16.2 18.85,13.7 R26.1 18.85,13.3 C17.2
  Top 0.508: R5.2 60.45,19.9 T5.2 | v17.1,38.9 18,39.8 18,40.38 17.81,40.56 17.81,40.65
  other vias: 27.2,8.2 16.7,9.7 22.8,1.9 18,16.1 27.7,10.4 22.8,13.6 21.8,11.6 11.6,18.1 8.6,18.7 33.7,3.7 37.5,5.9 38.5,14.2 38.5,20.1 35.1,20.3 35.1,22.9 34.2,35.9 30.6,37.1 20.5,43.8 20.5,46.7 12.3,45.8 14.8,3 9,2.5 64.9,6.6 68.2,11.7 64.7,11.6 55,11 51.3,11.4 44.8,6.7 36.2,14.6 64.8,9
  pour Top: 5,50 arc90 0,45 0,5 arc90 5,0 78,0 arc90 83,5 83,45 arc90 78,50
  pour Bottom: 5,50 arc90 0,45 0,5 arc90 5,0 78,0 arc90 83,5 83,45 arc90 78,50
IO0  (via drill 0.35)
  Top 0.406: IC6.4 11.9,28.4 v11.8,28.5 | v8.9,37.9 S1.3
  Bottom 0.406: v11.8,28.5 8.9,31.4 v8.9,37.9
LDR_LH  (via drill 0.4)
  Top 0.406: R8.2 PH1.2 3.35,42.6 11.3,42.6 12.6,41.3 v14.4,41.3 | v18.3,20.3 IC6.21
  Bottom 0.406: v14.4,41.3 14.4,39 14.4,31.4 15.3,30.5 15.3,20.8 15.8,20.3 v18.3,20.3
LDR_RH  (via drill 0.4)
  Top 0.406: R24.2 37.5,39.2 36.5,40.2 36.5,43.6 | PH2.2 37.65,44.75 36.5,43.6 | IC6.20 17.45,20.55 16.9,21.1 16.9,22.13 16.96,22.19 16.96,23.44 v16.2,24.2 | v16.2,45.1 28.4,45.1 29.9,43.6 36.5,43.6
  Bottom 0.406: v16.2,24.2 v16.2,45.1
LED_FRONT  (via drill 0.35)  (1 unrouted)
  Top 0.406: IC6.9 10.55,24.15 v9.7,25
  Top 0.508: R11.2 52.45,31.75 45.78,25.08 J5.3
  Bottom 0.406: v9.7,25 2.08,25 J4.3
LED_PB  (via drill 0.35, 0.4)  (1 unrouted)
  Top 0.406: J4.1 4.7,20 5.6,20.9 v5.6,26.1 | v10.5,26 11.7,26 11.85,25.85 IC6.7
  Top 0.508: PAD14.1 R15.2 69.6,10.05 v69.6,11.1
  Bottom 0.406: v5.6,26.1 10.4,26.1 v10.5,26
  Bottom 0.508: v69.6,11.1 68.4,9.9 46.9,9.9 45,11.8 J5.1
LED_REAR  (via drill 0.35, 0.4)  (1 unrouted)
  Top 0.406: v8.3,27.1 8.3,24.5 9.5,23.3 IC6.10
  Top 0.508: v65.9,37.2 66,37.3 R9.2
  Bottom 0.406: J4.4 7.78,27.62 v8.3,27.1
  Bottom 0.508: v65.9,37.2 66.4,37.2 68.3,35.3 68.3,32.4 63.52,27.62 J5.4
LEDK
  Top 0.406: U$1.2 16.23,39.58 R21.1
N$1
  Top 0.508: R1.2 53,47 PAD3.1
N$2
  Top 0.508: R9.1 68.85,37.3 70.05,38.5 T4.1
N$3
  Top 0.508: IC1.6 57.37,7.07 56.45,6.15 R10.2
N$4
  Top 0.508: T3.3 PAD4.1
N$5
  Top 0.508: T3.1 55.55,38.6 54.25,37.3 R11.1
N$6
  Top 0.508: T4.3 PAD2.1
N$7
  Top 0.508: D2.A 63.2,19 R5.1 62.9,18.75 62.9,18.2 62.6,17.9 59.9,17.9 58.55,19.25 T5.1
N$8
  Top 0.508: D1.C 58.9,23.7 59.25,23.35 | 59.25,23.35 T5.3 | R4.2 60.7,23.35 59.25,23.35
N$9
  Top 0.406: T1.3 32.8,6.1 35,3.9 T2.1 34.68,3.53 R2.2
N$10
  Top 0.508: PAD8.1 80.45,18.95 B1.AC2
N$11
  Top 0.508: LED1.C R7.1
N$12
  Top 0.508: R10.1 56.4,3.44 LED2.C
N$13
  Top 0.508: IC1.2 58.63,15.48 R6.2
N$14
  Top 0.508: B1.AC1 80.45,24.05 PAD7.1
N$15
  Top 0.508: R7.2 59.65,6.15 58.63,7.17 IC1.7
N$16
  Top 0.508: R14.1 72.2,31.55 Q5.1
N$17
  Top 0.508: Q5.3 77.9,36 PAD12.1
N$18
  Top 0.406: R3.2 30.55,1.8 T1.1
N$19
  Top 0.508: PAD11.1 78.5,30.5 JMP1.2
N$20
  Top 0.508: PAD1.1 67.9,47.4 R12.2
N$33
  Top 0.508: R21.2 13.45,38.1 T6.3
N$34  (via drill 0.4)
  Top 0.508: IC8.7 60.16,31.86 60.75,32.45 60.75,34.8 v60.95,35 60.95,35.6 R17.2
  Bottom 0.508: R19.E 53.31,42.64 v60.95,35
N$35  (via drill 0.4)
  Top 0.508: IC8.6 56.72,33.13 C11.1 56.5,33.35 v56.5,31.8 | v62.5,31.8 64.03,31.8 IC8.2
  Bottom 0.508: R19.S R19.A 51.9,31.8 v56.5,31.8 v62.5,31.8
N$36
  Top 0.508: IC8.3 64.14,33.1 65.8,33.1 66.5,32.4 66.5,31.4 67.1,30.8 JMP2.1
N$37
  Top 0.508: C9.1 59,34.51 IC8.5
N$38  (via drill 0.4)  (1 unrouted)
  Top 0.305: IC3.11 34.75,9.49 34.95,9.29 37.4,9.29 v37.5,9.4
  Bottom 0.305: v37.5,9.4 36.89,8.79 36.5,8.79
N$39  (via drill 0.4)
  Top 0.305: IC3.1 30.98,13.25 v30.96,13.27
  Bottom 0.305: 30,13.79 30.17,13.79 30.69,13.27 v30.96,13.27
  Bottom 0.508: 30,13.79 SJ2.2
N$40
  Top 0.305: IC3.10 34.25,8.7 C13.1
N$41
  Top 0.305: IC3.20 34.75,15.8 C12.1
N$43
  Top 0.305: IC3.8 33.25,8.7 C14.1
N$44  (via drill 0.4)
  Top 0.305: IC3.9 33.75,7.35 v34.3,6.8
  Bottom 0.305: v34.3,6.8 34,6.8 33.5,7.3 SJ1.2
N$46
  Top 0.508: T6.1 11.3,35.65 R22.2
N$47  (via drill 0.4)
  Top 0.406: IC4.6 14.13,14.92 v14.8,14.26 | v28.5,8.1 R28.2
  Bottom 0.406: v14.8,14.26 15.64,14.26 20.3,9.6 27,9.6 v28.5,8.1
N$48
  Top 0.406: R27.1 LED3.C
N$49
  Top 0.406: LED4.C R28.1
N$50
  Top 0.406: R26.2 14.2,13.5 12.87,12.16 IC4.2
N$51  (via drill 0.4)
  Top 0.406: R27.2 25.25,7.15 v25.2,7.2 | v12.7,13.5 12.7,14.91 IC4.7
  Bottom 0.406: v25.2,7.2 23.5,8.9 19.4,8.9 14.8,13.5 v12.7,13.5
RPM  (via drill 0.4)
  Top 0.406: R23.2 38.15,22.15 PAD10.1 32.6,21.5 27.1,16 23.56,16 v22.46,14.9 | v16.6,19.1 IC6.19
  Bottom 0.406: v22.46,14.9 18.26,19.1 v16.6,19.1
RST
  Top 0.406: IC6.45 28.95,30.95 32.55,34.55 R13.1 32.55,39.55 33.21,40.21 S2.3
RXD0
  Top 0.406: J18.4 30.46,26.7 IC6.40
SCL  (via drill 0.4)  (1 unrouted)
  Top 0.305: U$1.13 21.73,37.77 22.3,37.2 v22.3,36 | IC5.C2 25,14.9 | 25,15 25.1,15.1 | IC3.23 33.25,15.05
  Top 0.406: v23.96,24.4 24.21,24.15 IC6.37 | v23.6,14.9 25,14.9 | 25.1,15.1 33.3,15.1 | 33.3,15.1 33.5,15.3 R18.2 | 33.25,15.05 33.3,15.1
  Bottom 0.406: v22.3,36 22.3,26.06 | v23.96,24.4 22.3,26.06 | 22.3,26.06 22.3,16.2 v23.6,14.9
SDA  (via drill 0.4)
  Top 0.305: U$1.14 22.23,38.47 23.2,37.5 v23.2,36.7 | IC5.C1 27.18,14 27.2,13.97 IC3.24
  Top 0.406: IC6.38 25.1,25 v24.2,25.9 | 27.2,13.97 27.02,13.97 v27,14 | R20.2 31.15,15.85 v30.7,16.3
  Bottom 0.406: v23.2,36.7 23.4,36.5 23.4,26.7 v24.2,25.9 24.4,25.9 25,25.3 25,23.6 23.04,21.64 23.04,16.86 25.9,14 v27,14 29.3,16.3 v30.7,16.3
SENS  (via drill 0.4)
  Top 0.406: R3.1 32.9,2.25 v32.9,2.4 | v22.5,12.4 21.7,13.2 IC6.25
  Bottom 0.406: v32.9,2.4 29.6,5.7 29.6,9.8 27,12.4 v22.5,12.4
TFT_BL  (via drill 0.35)
  Top 0.406: R22.1 28.1,34.35 v28.1,34.1 | v28.5,27.5 28.55,27.5 28.5,27.55 IC6.41
  Bottom 0.406: v28.1,34.1 28.5,33.7 v28.5,27.5
TFT_CS  (via drill 0.4)
  Top 0.305: U$1.8 19.23,37.83 v17.3,35.9
  Top 0.406: v16.2,22.5 16.15,22.45 IC6.11
  Bottom 0.406: v17.3,35.9 17.3,23.6 v16.2,22.5
TFT_DC  (via drill 0.4)
  Top 0.305: U$1.7 18.73,38.53 v18.1,37.9
  Top 0.406: v17.9,21.8 23.5,21.8 24.15,22.45 IC6.35
  Bottom 0.406: v18.1,37.9 18.1,22 v17.9,21.8
TFT_MOSI  (via drill 0.4)
  Top 0.305: U$1.10 20.23,36.23 v20.46,36
  Top 0.406: IC6.31 25.85,19.05 24.9,20 v20.4,20
  Bottom 0.406: v20.4,20 20.4,35.94 v20.46,36
TFT_RST  (via drill 0.4)
  Top 0.305: U$1.11 20.73,37.37 v21.2,36.9
  Top 0.406: IC6.36 23.5,23.3 23.2,23.6 23.2,27.2 22,28.4 v21.4,28.4
  Bottom 0.406: v21.4,28.4 21.4,36.9 v21.2,36.9
TFT_SCK  (via drill 0.4)
  Top 0.305: U$1.9 19.73,36.73 v19.2,36.2
  Top 0.406: IC6.32 26.2,19.9 25.2,20.9 v19.3,20.9
  Bottom 0.406: v19.3,20.9 19.2,21 v19.2,36.2
TP_INT  (via drill 0.4)
  Top 0.305: U$1.16 23.23,39.67 25.6,37.3 v25.7,37.3
  Top 0.406: IC6.28 24.25,18.85 v24,19.1
  Bottom 0.406: v25.7,37.3 25.8,37.2 25.8,21 24,19.2 v24,19.1
TP_RST  (via drill 0.4)
  Top 0.305: U$1.15 22.73,39.07 26.2,35.6 v26.7,35.6
  Top 0.406: IC6.29 v25.1,16.8
  Bottom 0.406: v25.1,16.8 26.7,18.4 v26.7,35.6
TXD0
  Top 0.406: IC6.39 32.16,25.85 J18.3
UC_BUZZER  (via drill 0.4)  (1 unrouted)
  Top 0.406: IC6.12 8.2,21.6 7.5,22.3 7.5,29.1 6.44,30.16 J4.5
  Top 0.508: JMP2.3 v66.9,34.2
  Bottom 0.508: v66.9,34.2 63.4,30.7 63.36,30.66 62.86,30.16 J5.5
V_BUZZ
  Top 0.508: R17.1 62.65,35.85 IC8.4 62.2,34.41 61.61,33.81 61.61,31.91 60.3,30.59 IC8.8
V_DYN_UR
  Top 0.508: C3.1 52.65,18.56 U1.3 52.31,22.41 53.48,23.57 C2.+ 53.48,27.68 54.8,29 58.5,29 62.65,24.85 R4.1 64.2,24 D2.C | TP1.TP 64.8,24 D2.C | D2.C 64.85,24.05 B1.+
V_REG
  Top 0.508: LED2.A LED1.A 61.34,1.64 62,2.3 62,7.6 61.18,8.42 IC1.8 59.91,9.29 58.1,11.1 56.95,11.1 54.9,13.15 | 54.9,13.15 C4.1 51.95,13.15 C5.1 49.6,16.6 | 54.9,13.15 55.66,13.15 IC1.4 | TP3.TP 45.5,15.8 46.5,16.8 49.4,16.8 49.6,16.6 | 49.6,16.6 50,17 U1.2
VBAT  (via drill 0.4)
  Top 0.305: IC5.A3 24.5,10.95 C40.1
  Top 0.406: C16.1 17.07,15.08 v16.1,15.08 IC4.5 15.4,16.3 15.05,16.65 R25.2 7.65,16.65 5.2,14.2 5.2,6.3 | C18.1 11.56,1.59 IC7.1 11.56,3.94 | IC7.3 13.44,4.36 13.2,4.6 11.8,4.6 11.56,4.36 11.56,3.94 | J1.1 4.5,5.6 5.2,6.3 | 5.2,6.3 9.2,6.3 11.56,3.94 | C40.1 22.9,10.6 v22.8,10.5
  Bottom 0.406: v16.1,15.08 20.68,10.5 v22.8,10.5
VBAT_1
  Top 0.508: IC2.1 45.74,10.44 45.5,10.2 45.5,8.9 45.84,8.56 IC2.3 47.15,8.16 C8.1 47.15,5.45 47.6,5 51.7,5 52,5.3 | IC1.5 55.33,7.65 C1.1 53,6.3 52.15,5.45 52,5.3 | 52,5.3 PAD5.1
VBUS  (via drill 0.35, 0.4)
  Top 0.406: IC4.8 v11.6,12.4 | v17.6,7.02 17.55,6.97 | IC4.4 15.4,11.6 v15.2,11.8 16.95,11.8 C17.1 | LED4.A LED3.A 24.94,3.2 19.7,3.2 v19.5,3.4 | J7.VBUS2 22.45,6.85 v22.9,7.3
  Top 0.508: v17.6,7.02 17.6,6.21 J7.VBUS1
  Bottom 0.406: v11.6,12.4 12.12,12.4 13.81,10.71 13.91,10.71 | 13.91,10.71 v17.6,7.02 | v15.2,11.8 14.11,10.71 13.91,10.71 | v19.5,3.4 19.5,5.12 v17.6,7.02 | v22.9,7.3 17.88,7.3 v17.6,7.02
VSENS  (via drill 0.4)  (1 unrouted)
  Top 0.406: U$1.3 16.73,42.53 17.1,42.9 17.4,42.9 | 22.6,42.9 22.7,42.9 23.73,41.87 U$1.17 | 22.6,42.9 16.9,42.9 12,47.8 5.05,47.8 PH1.1 | R20.1 R18.1 v34.52,18.18 35.15,18.8 PAD9.1 37.5,16.9 37.76,16.65 37.76,14.66 36.9,13.8 36.9,11 37.1,11 | 37.1,11 37.85,11 C15.1 | 37.1,11 36.85,10.75 IC3.13 36.6,10.15 v36.6,10.1 | T2.3 35.6,5.7 v35,5.7 | v22.6,43 22.6,42.9
  Bottom 0.406: v35,5.7 33.7,5.7 32.69,6.71 SJ1.1 32.69,9.09 33.1,9.5 36,9.5 v36.6,10.1 | PH2.1 32.3,41.25 24.35,41.25 v22.6,43
  Bottom 0.508: 32.3,41.25 32.3,20.4 v34.52,18.18

### Text on the board
tNames: JLCJLCJLCJLC | STBY | STBY | CHG | CHG